# EAGLE design heart_capTouch (EAGLE 9.3.0)
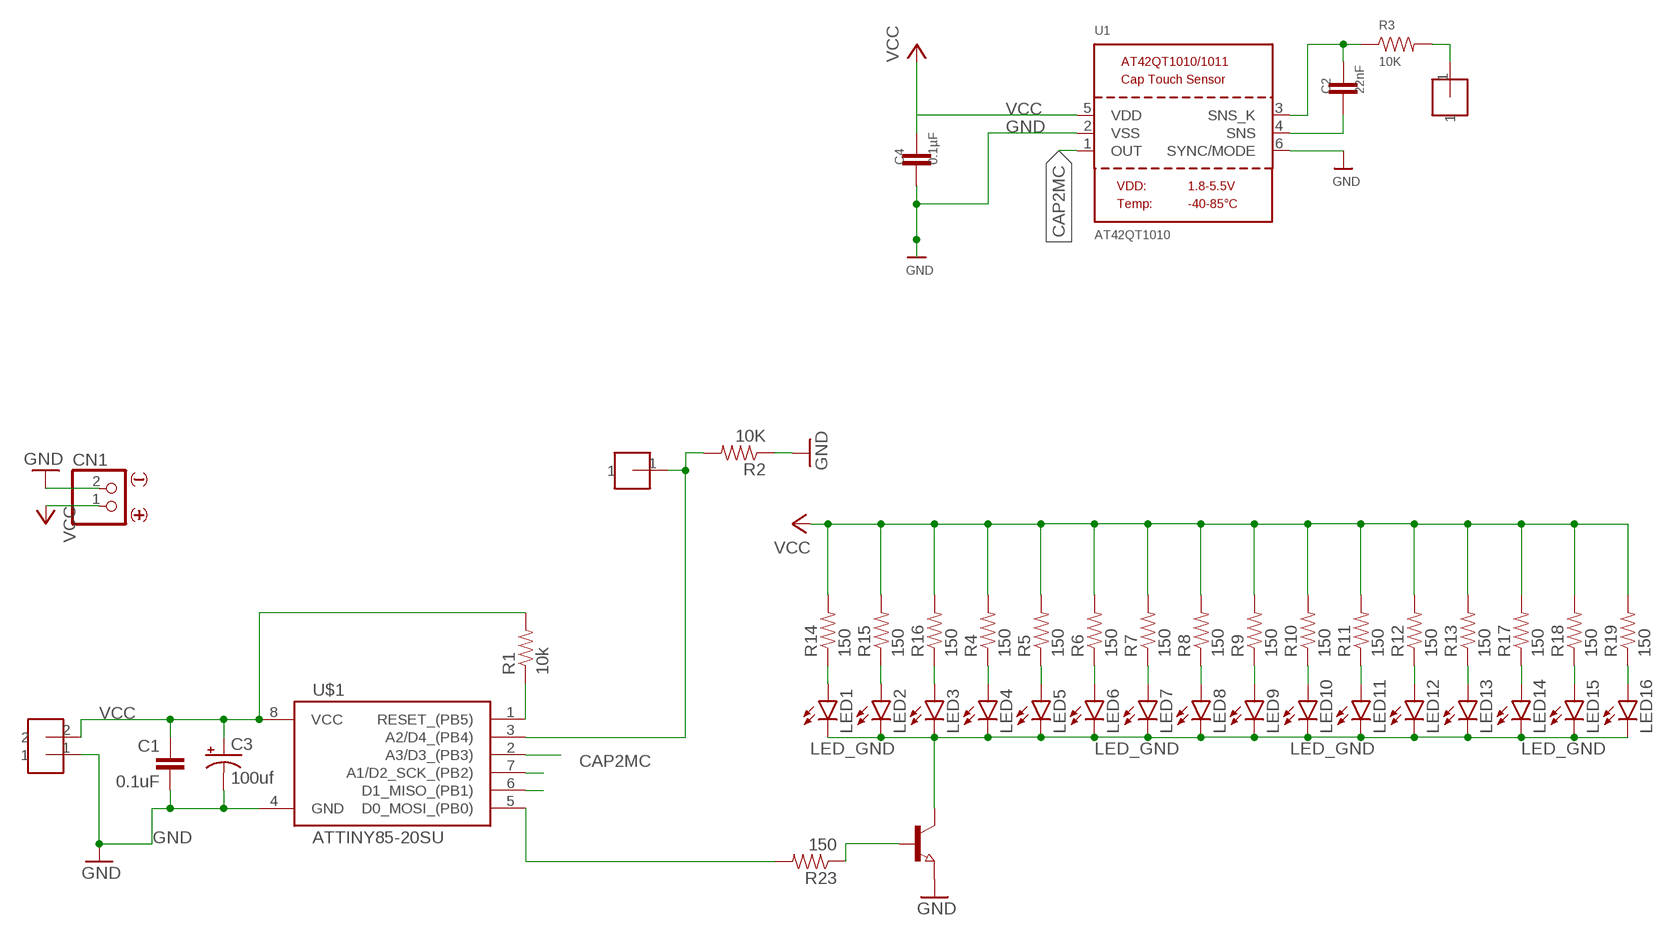
[diagram p0: schematic, sheet 1]

## Parts
C1  0.1uF  CAP-0805  [0805]
C2  22nF  CAP-0805  [0805]
C3  100uf  CAP_POLD  [PANASONIC_D]
C4  0.1µF  CAP-0805  [0805]
CN1  JST_2PIN_BATTERY-SMT-HORIZ  [JST-PH-2-SMT-RA]
LED1  LED0603  [LED-0603]
LED2  LED0603  [LED-0603]
LED3  LED0603  [LED-0603]
LED4  LED0603  [LED-0603]
LED5  LED0603  [LED-0603]
LED6  LED0603  [LED-0603]
LED7  LED0603  [LED-0603]
LED8  LED0603  [LED-0603]
LED9  LED0603  [LED-0603]
LED10  LED0603  [LED-0603]
LED11  LED0603  [LED-0603]
LED12  LED0603  [LED-0603]
LED13  LED0603  [LED-0603]
LED14  LED0603  [LED-0603]
LED15  LED0603  [LED-0603]
LED16  LED0603  [LED-0603]
Q5  TRANSISTOR-NPN-SOT23  [SOT23]
R1  10k  RESISTOR-0805  [0805]
R2  10K  RESISTOR-0805  [0805]
R3  10K  RESISTOR-0805  [0805]
R4  150  RESISTOR0603  [0603-RES]
R5  150  RESISTOR0603  [0603-RES]
R6  150  RESISTOR0603  [0603-RES]
R7  150  RESISTOR0603  [0603-RES]
R8  150  RESISTOR0603  [0603-RES]
R9  150  RESISTOR0603  [0603-RES]
R10  150  RESISTOR0603  [0603-RES]
R11  150  RESISTOR0603  [0603-RES]
R12  150  RESISTOR0603  [0603-RES]
R13  150  RESISTOR0603  [0603-RES]
R14  150  RESISTOR0603  [0603-RES]
R15  150  RESISTOR0603  [0603-RES]
R16  150  RESISTOR0603  [0603-RES]
R17  150  RESISTOR0603  [0603-RES]
R18  150  RESISTOR0603  [0603-RES]
R19  150  RESISTOR0603  [0603-RES]
R23  150  RESISTOR-0805  [0805]
U1  AT42QT1010  AT42QT1010/1  [SOT23-6]
U$1  ATTINY85-20SU  [SOIC8]
U$2  HEADER-2-TESTPOINT  [TESTPOINT-2]
U$4  HEADER-1-TESTPOINT  [TESTPOINT-1]
U$6  HEADER-1-TESTPOINT  [TESTPOINT-1]

## Nets
CAP2MC: U1.1(OUT) U$1.2(A3/D3_(PB3))
CAPPAD: R3.2 U$6.1
GND: C1.2 C3.- C4.2 CN1.2 Q5.2(E) R2.1 U1.2(VSS) U1.6(SYNC/MODE) U$1.4(GND) U$2.1
LED_GND: LED1.C LED2.C LED3.C LED4.C LED5.C LED6.C LED7.C LED8.C LED9.C LED10.C LED11.C LED12.C LED13.C LED14.C LED15.C LED16.C Q5.3(C)
N$1: LED4.A R4.1
N$2: R23.2 U$1.5(D0_MOSI_(PB0))
N$4: LED15.A R18.1
N$5: LED1.A R14.1
N$6: LED2.A R15.1
N$7: LED5.A R5.1
N$8: LED6.A R6.1
N$9: LED7.A R7.1
N$10: LED8.A R8.1
N$11: LED9.A R9.1
N$12: LED10.A R10.1
N$13: LED11.A R11.1
N$14: LED12.A R12.1
N$15: LED13.A R13.1
N$16: LED3.A R16.1
N$17: R2.2 U$1.3(A2/D4_(PB4)) U$4.1
N$19: U$1.6(D1_MISO_(PB1))
N$20: LED16.A R19.1
N$21: U$1.7(A1/D2_SCK_(PB2))
N$22: LED14.A R17.1
N$23: Q5.1(B) R23.1
N$26: C2.2 U1.4(SNS)
N$27: C2.1 R3.1 U1.3(SNS_K)
RESET: R1.1 U$1.1(RESET_(PB5))
VCC: C1.1 C3.+ C4.1 CN1.1 R1.2 R4.2 R5.2 R6.2 R7.2 R8.2 R9.2 R10.2 R11.2 R12.2 R13.2 R14.2 R15.2 R16.2 R17.2 R18.2 R19.2 U1.5(VDD) U$1.8(VCC) U$2.2

## Library data of the parts
C1 C2 C4 = homemade-hardware:CAP: Capacitor Standard 0603 ceramic capacitor, and 0.1" leaded capacitor.
C3 = homemade-hardware:CAP_POL: Capacitor Polarized These are standard SMD and PTH capacitors. Normally 10uF, 47uF, and 100uF in electrolytic and tantalum varieties. Always verify the external diameter of the through hole cap, it varies with capacity, voltage, and manufacturer. The EIA devices should be standard.
CN1 = homemade-hardware:JST_2PIN_BATTERY: JST 2-Pin Connectors of various flavors SMT-HORIZ (S2B-PH-SM4) SMT-VERT (B2B-PH-SM4) DIP-HORIZ (S2B-PH) DIP-VERT (B2B-PH)
LED1-LED16 = homemade-hardware:LED: LEDs Standard schematic elements and footprints for 5mm, 3mm, 1206, and 0603 sized LEDs. 5mm - Spark Fun Electronics SKU : COM-00529 (and others)
Q5 = homemade-hardware:TRANSISTOR-NPN: NPN Transistor BJT <https://www.digikey.com/product-detail/en/micro-commercial-co/MMBT2222A-TP/MMBT2222ATPMSCT-ND/717394>: MMBT2222A
R1-R19 R23 = homemade-hardware:RESISTOR: Resistor Basic schematic elements and footprints for 0603, 1206, and PTH resistors.
U1 = microbuilder:AT42QT1010/1: AT42QT1010/1011 - Single Button Cap Touch Sensors AT42QT1010 - Auto recalibration AT42QT1011 - Remains on as long as touch is detected
U$1 = homemade-hardware:ATTINY85
U$2 = homemade-hardware:HEADER-2
U$4 U$6 = homemade-hardware:HEADER-1

## Board
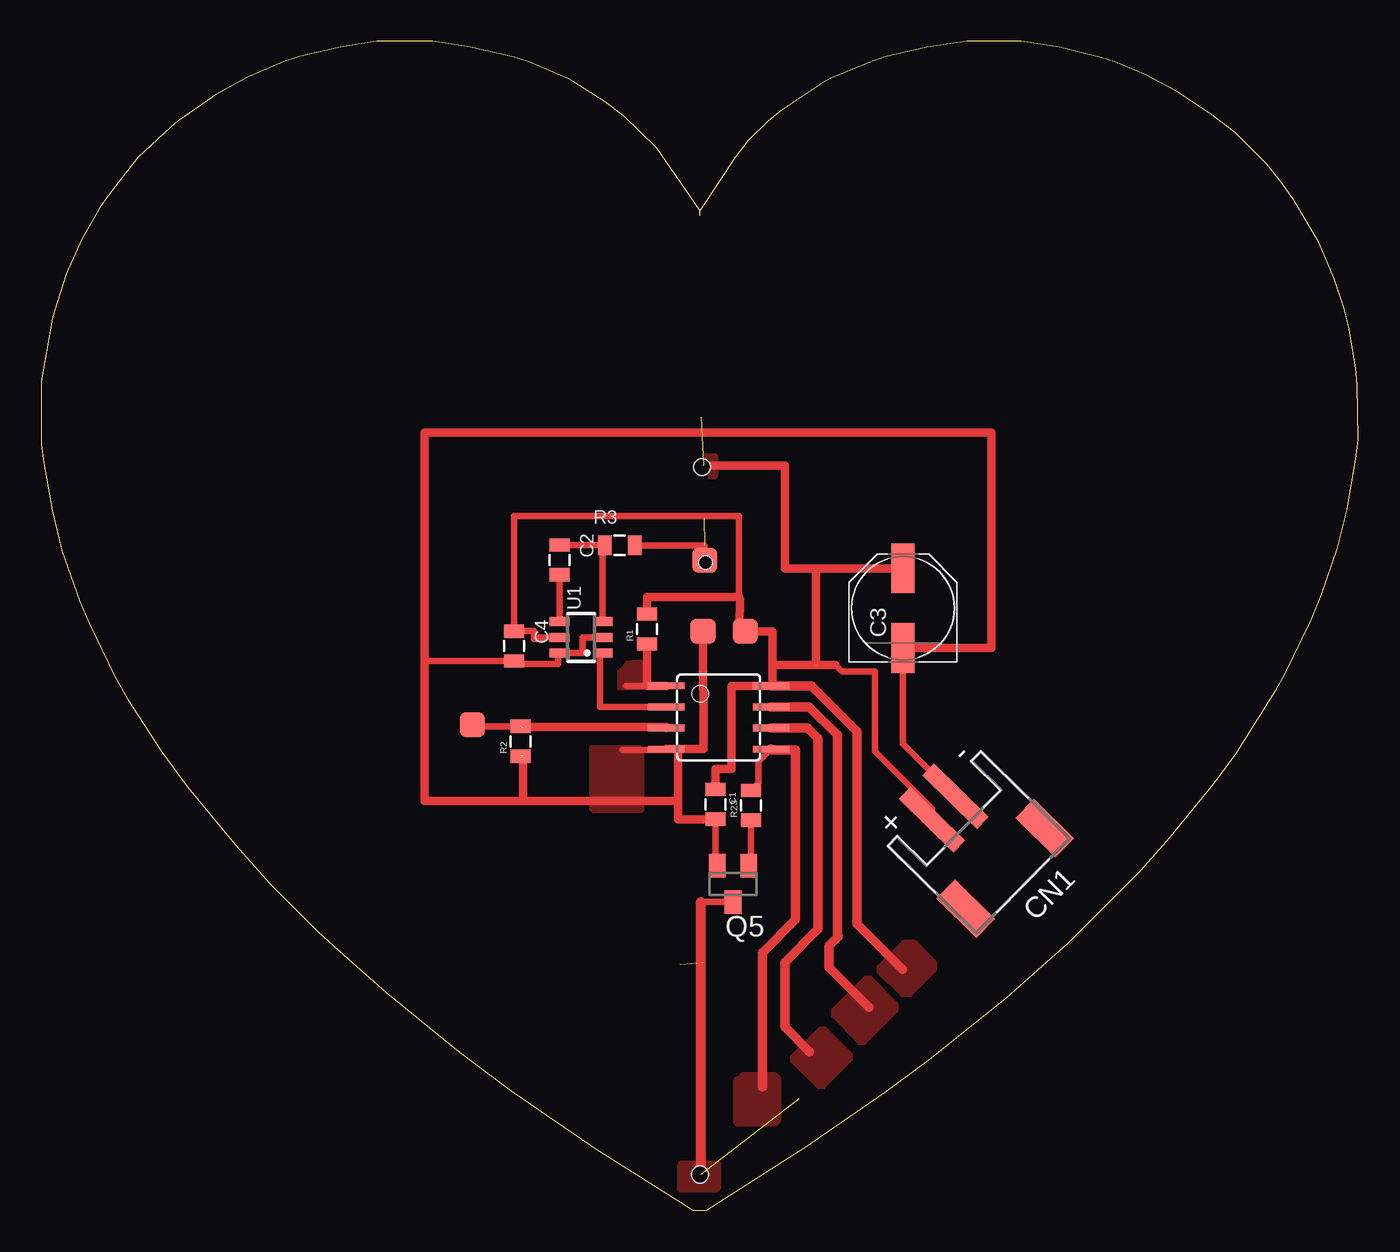
[diagram p1: board, top side]
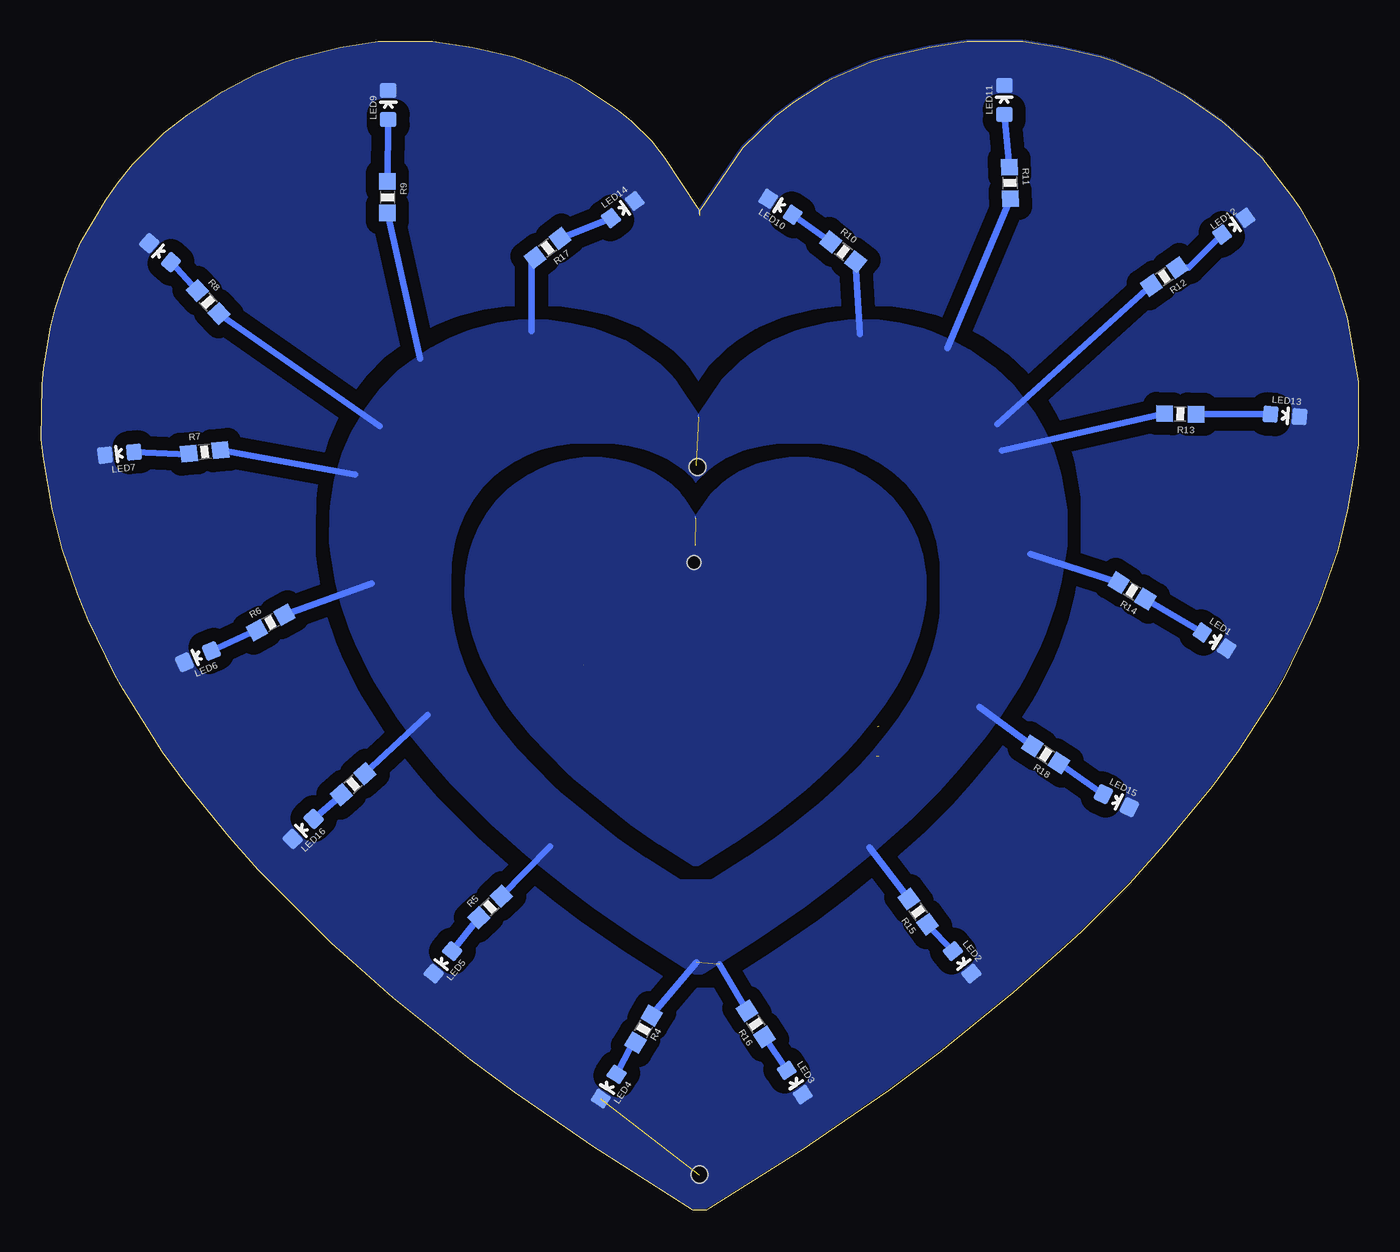
[diagram p2: board, bottom side, seen from below]

Size 79.4 x 70.5 mm. Coordinates in mm from the lower left corner, seen from the top.
Outline: 39.7,60 39.7,60.3
Outline: 39.7,60.3 37.1,64.1 35.12,66.02 33.98,66.88 32.09,68.08 31.69,68.28 29.39,69.27 28.51,69.53 25.89,70.16 23.6,70.5 20.2,70.5 18.01,70.16 15.51,69.56 14.61,69.27 12.51,68.38 12.39,68.32 10.51,67.28 10.29,67.12 8.22,65.68 7.78,65.32 5.8,63.5 4.02,61.19 3.52,60.48 2.42,58.59 1.48,56.51 0.77,54.21 0.64,53.79 0,50 0,46.2 0.14,45.1 0.63,42.21 1.23,39.81 2.32,36.71 2.88,35.39 4.42,32.22 5.18,30.89 7.22,27.72 8.78,25.58 11.67,22.08 13.8,19.7 16.7,16.8 18.22,15.43 20.82,13.12 25.18,9.58 28.32,7.22 33.12,3.92 33.41,3.72 39.11,0.12 39.19,0.08 39.3,0 40.1,0 45.78,3.62 46.02,3.78 50.88,7.12 53.52,9.08 58.18,12.82 60.62,14.97 61.9,16.1 66.3,20.5 68.08,22.52 70.72,25.78 72.08,27.62 74.48,31.42 74.98,32.32 76.58,35.61 77.22,37.19 78.14,39.89 78.77,42.31 79.25,45.3 79.4,46.5 79.34,49.8 79.25,50.8 78.84,53.31 78.56,54.39 77.98,56.19 77.02,58.41 75.52,60.92 74.82,61.92 73.9,63.1 72,65 70.58,66.08 68.49,67.48 66.51,68.52 64.69,69.27 63.91,69.53 61.39,70.16 59.1,70.5 55.8,70.5 53.39,70.14 50.91,69.56 49.89,69.23 47.61,68.28 46.99,67.92 44.82,66.48 44.48,66.22 43.8,65.7 42.6,64.5 42.12,63.88 41.82,63.48 39.82,60.48 39.7,60.3
Copper layers (1*16): Top 0.035mm / dielectric 1.5mm / Bottom 0.035mm
Design rules "default": minimum track width 16mil, minimum drill 0.8mm, track to track 0.8mm, track to pad 0.8mm, pad to pad 0.8mm, via to via 0.8mm, smd to smd 0mil, copper to edge 1mil, drill to drill 1mil, minimum pad ring 10mil, minimum via ring 10mil, stop-mask expansion 1mil, vias tented up to drill 30mil, thermal gap 10mil
Holes 1 mm at 39.72,2.17 39.84,44.83
Holes 0.8 mm at 40.04,39.08

### Footprints (pad centres in the part's own frame; a part is rotated, then mirrored left to right if it is on the bottom)
0805 = smd 0.8 x 1.2: 1 -0.9,0; 2 0.9,0
PANASONIC_D = smd 3 x 1.4: + 2.4,0; - -2.4,0
JST-PH-2-SMT-RA = smd 1 x 4.6: 1 1,-3.7; 2 -1,-3.7 | smd 1.6 x 3.4: NC1 -3.4,1.5; NC2 3.4,1.5
LED-0603 = smd 1 x 0.9: A 0,-0.877; C 0,0.877
SOT23 = smd 1 x 1.4: 1 -0.95,-1.1; 2 0.95,-1.1; 3 0,1.1
0603-RES = smd 1 x 1: 1 -0.95,0; 2 0.95,0
SOT23-6 = smd 0.55 x 1.2: 1 -0.95,-1.3; 2 0,-1.3; 3 0.95,-1.3; 4 0.95,1.3; 5 0,1.3; 6 -0.95,1.3
SOIC8 = smd 0.4 x 2.2: 1 -1.905,-3.154; 2 -0.635,-3.154; 3 0.635,-3.154; 4 1.905,-3.154; 5 1.905,3.154; 6 0.635,3.154; 7 -0.635,3.154; 8 -1.905,3.154
TESTPOINT-2 = smd 1.524 x 1.524: 1 0,0; 2 2.54,0
TESTPOINT-1 = smd 1.524 x 1.524: 1 0,0

### Placement (x,y rotation side)
C1  40.65,24.49 270 top
C2  31.24,39.23 270 top
C3  51.96,36.33 90 top
C4  28.51,34.03 270 top
CN1  57.05,21.68 225.5 top
LED1  8.66,34.38 237 bottom
LED2  23.87,14.96 219.5 bottom
LED3  33.97,7.72 213.5 bottom
LED4  45.19,7.47 146.8 bottom
LED5  55.19,14.96 140.4 bottom
LED6  69.97,33.4 113 bottom
LED7  74.69,45.64 96.1 bottom
LED8  72.25,57.76 48.7 bottom
LED9  58.49,66.66 0 bottom
LED10  34.84,60.53 56.7 bottom
LED11  21.34,66.97 0 bottom
LED12  7.49,59.37 305.2 bottom
LED13  4.4,47.94 265 bottom
LED14  44.34,60.37 305.9 bottom
LED15  14.57,24.71 243.5 bottom
LED16  63.62,23.01 133.9 bottom
Q5  41.7,19.7 180 top
R1  36.52,35.07 90 top
R2  28.9,28.29 90 top
R3  34.87,40.11 0 top
R4  43.09,10.94 59.4 bottom
R5  52.35,18.3 43.9 bottom
R6  65.59,35.46 28.9 bottom
R7  69.55,45.75 5.9 bottom
R8  69.35,54.78 313.1 bottom
R9  58.53,61.1 270 bottom
R10  31.05,57.82 321.6 bottom
R11  21,61.97 271.8 bottom
R12  11.68,56.33 214.3 bottom
R13  10.72,48.04 179 bottom
R14  13.63,37.37 148.7 bottom
R15  26.52,18.02 126.3 bottom
R16  36.32,11.25 123.7 bottom
R17  48.88,58.04 217.4 bottom
R18  18.84,27.49 147 bottom
R19  60.6,25.71 42.1 bottom
R23  42.8,24.43 90 top
U1  32.55,34.56 90 top
U$1  40.84,29.73 270 top
U$2  39.9,34.92 0 top
U$4  25.99,29.3 90 top
U$6  39.99,39.22 0 top

### Tracks (layer width: path | path; a pad name or v marks a point on that pad's centre or on a via)
CAP2MC
  Top 0.406: U$1.2 33.68,30.36 33.68,33.61 U1.1
CAPPAD  (1 unrouted)
  Top 0.406: R3.2 39.99,40.11 U$6.1
  Bottom 0.001: 39.95,41.77 39.95,41.87
  pour Bottom: 26.05,38.27 26.05,36.94 26.1,36.55 26.27,35.54 26.48,34.7 26.86,33.61 27.06,33.15 27.6,32.04 27.86,31.58 28.58,30.47 29.12,29.72 30.14,28.49 30.88,27.66 31.9,26.65 32.43,26.16 33.34,25.36 34.86,24.12 35.96,23.29 37.64,22.14 37.75,22.07 39.74,20.81 39.77,20.79 39.81,20.77 40.09,20.77 42.08,22.03 42.16,22.09 43.86,23.26 47.27,26.01 47.72,26.4 49.88,28.65 50.8,29.79 51.28,30.43 52.12,31.76 52.29,32.08 52.85,33.23 53.08,33.78 53.4,34.73 53.62,35.57 53.79,36.62 53.84,37.04 53.82,38.2 53.79,38.54 53.64,39.42 53.55,39.8 53.34,40.43 53.01,41.21 52.48,42.09 52.24,42.44 51.92,42.85 51.25,43.52 50.75,43.89 50.02,44.38 49.33,44.75 48.69,45.01 48.42,45.1 47.54,45.32 46.74,45.44 45.58,45.44 44.74,45.32 43.87,45.11 43.51,45 42.71,44.66 42.5,44.54 41.74,44.03 41.62,43.94 41.38,43.76 40.96,43.34 40.79,43.12 40.69,42.98 39.99,41.93 39.95,41.87 39.04,43.2 38.34,43.87 37.94,44.17 37.28,44.59 37.14,44.66 36.34,45.01 36.03,45.1 35.11,45.32 34.31,45.44 33.12,45.44 32.35,45.32 31.48,45.11 31.16,45.01 30.43,44.7 30.39,44.68 29.73,44.31 29.65,44.26 28.93,43.75 28.77,43.63 28.08,42.99 27.46,42.18 27.28,41.93 26.9,41.27 26.57,40.54 26.32,39.74 26.27,39.59
GND  (1 unrouted)
  Top 0.406: C1.2 40.65,20.9 Q5.2 | U1.2 32.63,34.56 32.63,33.61 U1.6 31.15,33.61 31.15,32.96 28.51,32.96 C4.2 23.1,33.13 23.1,33.07 | C3.- 51.96,28.14 CN1.2 | U$1.4 37.63,27.77 35.04,27.77
  Top 0.508: U$2.1 39.88,34.9 39.93,27.82 38.38,27.82 | 38.38,27.82 U$1.4 | 38.38,24.69 38.38,27.82 | 40.47,23.59 C1.2 38.38,23.59 38.38,24.69 | 38.38,24.69 29.03,24.69 | 29.03,24.69 29.03,27.39 | C3.- 57.29,33.93 57.29,46.91 23.1,46.91 23.1,33.07 23.1,24.69 29.03,24.69
  pour Top: 31.52,24.71 31.46,24.66 35.34,24.66
  pour Top: 33.23,27.92 33.23,24.21 33.28,24.15 33.3,24.14 36.17,24.14 36.17,27.78 36.01,27.93 33.23,27.93
LED_GND  (1 unrouted)
  Top 0.406: Q5.3 39.75,18.59
  Top 0.61: 39.75,18.59 39.75,2.15
  Bottom 0.001: 39.74,60.09 39.74,60.39
  pour Top: 38.54,2.7 38.54,1.29 38.52,1.27 40.66,1.27 40.79,1.4 40.79,2.83 38.58,2.83
  pour Bottom (rank 3, no thermals): 0.04,50.1 0.04,46.3 0.19,45.2 0.68,42.3 1.28,39.9 2.36,36.8 2.92,35.49 4.46,32.31 5.22,30.99 7.26,27.81 8.82,25.68 11.72,22.17 13.84,19.79 16.74,16.89 18.26,15.52 20.86,13.22 25.22,9.67 28.36,7.32 33.16,4.02 33.46,3.82 39.15,0.22 39.23,0.18 39.34,0.1 40.14,0.1 45.82,3.72 46.06,3.87 50.92,7.22 53.56,9.17 58.22,12.92 60.66,15.07 61.94,16.2 66.34,20.59 68.12,22.62 70.76,25.88 72.12,27.71 74.52,31.51 75.02,32.41 76.62,35.71 77.26,37.29 78.18,39.99 78.8,42.4 79.29,45.4 79.44,46.6 79.39,49.9 79.29,50.89 78.88,53.4 78.6,54.49 78.02,56.29 77.06,58.51 75.56,61.01 74.86,62.01 73.94,63.2 72.04,65.09 70.62,66.17 68.53,67.58 66.55,68.62 64.73,69.37 63.95,69.62 61.43,70.25 59.14,70.59 55.84,70.59 53.43,70.24 50.95,69.66 49.93,69.33 47.65,68.38 47.03,68.02 44.86,66.57 44.52,66.32 43.84,65.8 42.64,64.59 42.16,63.97 41.86,63.58 39.86,60.58 39.74,60.39 37.14,64.2 35.16,66.12 34.02,66.97 32.13,68.17 31.73,68.38 29.43,69.37 28.55,69.63 25.93,70.25 23.64,70.59 20.24,70.59 18.05,70.25 15.55,69.66 14.65,69.37 12.55,68.48 12.43,68.42 10.56,67.37 10.32,67.22 8.26,65.77 7.82,65.42 5.84,63.59 4.06,61.28 3.56,60.58 2.46,58.69 1.52,56.61 0.8,54.3 0.68,53.89
N$1
  Bottom 0.406: LED4.A 43.8,9.95 R4.1
N$2
  Top 0.406: R23.2 43.23,25.77 43.23,27.06 U$1.5 44.48,27.82
  Top 0.56: U$1.5 44.04,27.79 45.48,27.79 45.48,17.54 43.47,15.53 43.47,7.44
  pour Top: 42,7.81 42,5.35 44.21,5.35 44.32,5.46 44.32,7.92 44.18,8.07 42.34,8.07 42.03,7.75
N$4
  Bottom 0.406: LED15.A R18.1
N$5
  Bottom 0.406: LED1.A R14.1
N$6
  Bottom 0.406: LED2.A R15.1
N$7
  Bottom 0.406: LED5.A R5.1
N$8
  Bottom 0.406: 66.32,34.82 R6.1 LED6.A
N$9
  Bottom 0.406: R7.1 70.5,45.6 LED7.A
N$10
  Bottom 0.406: LED8.A R8.1
N$11
  Bottom 0.406: LED9.A R9.1
N$12
  Bottom 0.406: LED10.A R10.1
N$13
  Bottom 0.406: LED11.A R11.1
N$14
  Bottom 0.406: LED12.A 10.21,56.86 R12.1
N$15
  Bottom 0.406: LED13.A R13.1
N$16
  Bottom 0.406: LED3.A R16.1
N$17  (1 unrouted)
  Top 0.406: R2.2 25.99,29.19 U$4.1
  Top 0.508: 28.99,29.15 37.69,29.15 U$1.3 | U$4.1 26.01,29.28
N$19
  Top 0.406: U$1.6 44.06,29.03
  Top 0.56: U$1.6 46.21,29.09 46.84,28.46 46.84,16.98 44.83,14.97 44.83,11.06 46.33,9.57
  pour Top: 45.39,9.11 47,7.5 48.72,9.22 48.72,9.27 47.1,10.89 47.09,10.89 45.37,9.17 45.37,9.14
N$20
  Bottom 0.406: LED16.A R19.1
N$21
  Top 0.56: U$1.7 46.3,30.36 48,28.66 48,16.58 48.06,16.52 47.5,15.96 47.5,14.66 49.91,12.25
  pour Top: 47.87,11.83 49.47,10.24 49.47,10.17 51.45,12.16 51.45,12.22 51.45,12.34 49.83,13.95 47.83,11.95 47.83,11.91
N$22
  Bottom 0.406: LED14.A R17.1
N$23
  Top 0.406: R23.1 42.8,20.94 Q5.1
N$26
  Top 0.406: U1.4 C2.2
N$27
  Top 0.406: U1.3 33.85,40.11 | 33.85,40.11 R3.1 | C2.1 33.85,40.13 33.85,40.11
RESET
  Top 0.406: 36.52,31.63 35.25,31.63
  Top 0.508: R1.1 36.52,31.63 U$1.1
  pour Top: 34.57,32.88 34.57,31.3 34.66,31.2 34.71,31.16 36.13,31.16 36.13,33.04
VCC  (3 unrouted)
  Top 0.406: U1.5 29.81,34.56 29.81,34.48 29.72,34.48 29.72,34.93 C4.1 28.51,41.87 41.11,41.87 42.08,41.87 42.08,36.98 42.08,36.88 | 47.88,32.89 48.27,32.5 50.25,32.5 50.25,27.69 53.71,24.23 CN1.1
  Top 0.508: 44.09,32.88 44.09,34.92 U$2.2 42.11,35.25 42.13,36.88 42.08,36.88 | 44.09,32.88 44.09,31.63 U$1.8 41.63,31.63 41.63,26.62 40.65,26.62 C1.1 | 42.08,36.98 36.52,36.98 R1.2 | 46.72,32.89 47.88,32.89 | 44.09,32.88 46.72,32.88 46.72,38.73 C3.+ 44.83,38.73 44.83,44.93 39.93,44.93
  Top 0.56: U$1.8 46.44,31.63 49.19,28.89 49.19,17.29 51.93,14.55
  Bottom 0.001: 39.79,47.84 39.79,48.01
  Bottom 0.406: R4.2 39.9,14.97 | R9.2 56.55,51.38 | R10.2 30.05,52.84 | R11.2 24.77,52 | R12.2 21.74,47.41 | R17.2 49.85,57.47 49.85,53.05 | R16.2 38.51,14.84 | R15.2 29.45,21.88 | R13.2 21.48,45.84 | R14.2 19.75,39.59 | R18.2 22.82,30.37 | R8.2 59.02,47.3 | R7.2 60.48,44.39 | R6.2 59.48,37.82 | R19.2 56.11,29.88 | R5.2 48.73,21.95
  pour Bottom (rank 2): 17.56,42.24 17.56,40.11 17.64,39.5 17.91,37.88 18.25,36.53 18.86,34.8 19.17,34.06 20.03,32.28 20.46,31.54 21.6,29.76 22.47,28.57 24.1,26.6 25.28,25.27 26.91,23.65 27.76,22.88 29.22,21.59 31.66,19.6 33.42,18.29 36.1,16.44 36.27,16.32 39.46,14.31 39.5,14.28 39.56,14.24 40.01,14.24 43.2,16.27 43.33,16.36 46.05,18.23 47.53,19.32 50.14,21.42 51.51,22.63 52.22,23.26 54.69,25.72 55.68,26.85 57.16,28.68 57.92,29.71 59.26,31.83 59.54,32.34 60.44,34.18 60.8,35.07 61.31,36.58 61.67,37.93 61.94,39.61 62.02,40.28 61.99,42.13 61.94,42.69 61.71,44.09 61.55,44.7 61.23,45.71 60.69,46.95 59.85,48.35 59.46,48.91 58.94,49.58 57.88,50.64 57.08,51.24 55.91,52.03 54.8,52.61 53.78,53.03 53.35,53.18 51.94,53.53 50.65,53.72 48.8,53.72 47.46,53.52 46.07,53.2 45.5,53.01 44.22,52.48 43.87,52.28 42.66,51.47 42.47,51.33 42.09,51.03 41.41,50.36 41.15,50.01 40.98,49.79 39.86,48.11 39.79,48.01 38.33,50.14 37.22,51.21 36.59,51.69 35.53,52.36 35.3,52.48 34.02,53.03 33.52,53.18 32.06,53.53 30.77,53.72 28.87,53.72 27.64,53.53 26.24,53.2 25.74,53.03 24.56,52.53 24.5,52.5 23.45,51.92 23.32,51.83 22.16,51.02 21.91,50.82 20.8,49.8 19.81,48.5 19.53,48.11 18.91,47.05 18.39,45.89 17.99,44.6 17.91,44.36
  pour Top: 39.12,45.44 39.12,44.36 39.2,44.28 40.58,44.28 40.61,44.31 40.61,45.48 39.14,45.48 39.12,45.46
  pour Top: 50.57,14.55 52,13.12 52.28,13.12 53.73,14.57 53.73,14.65 53.73,14.91 52.61,16.04 52.06,16.04 50.59,14.57